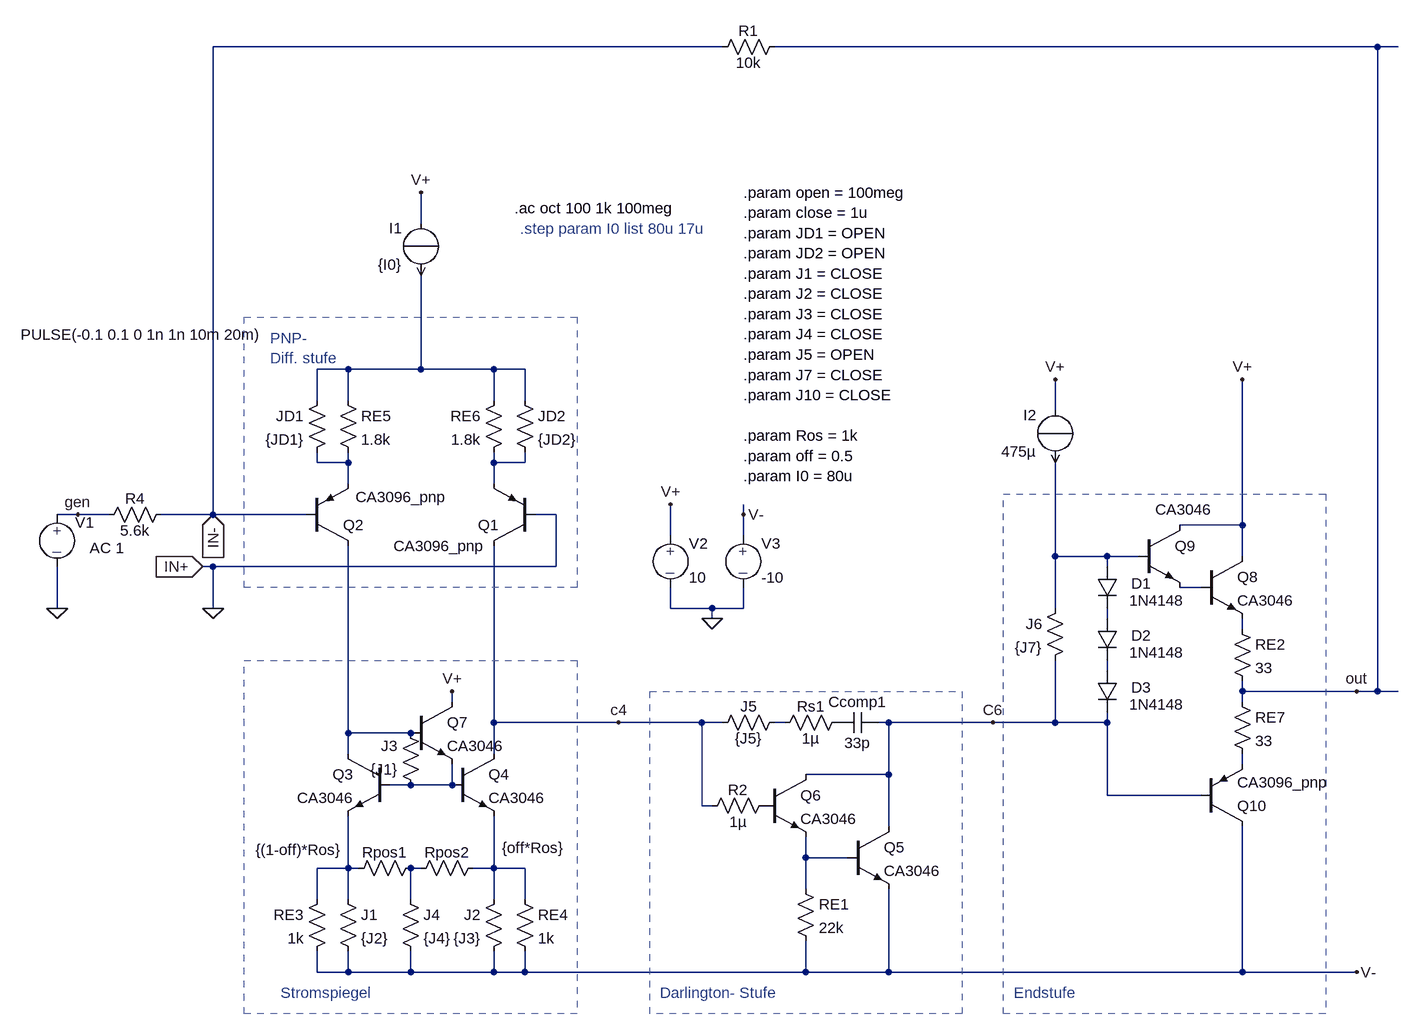
[diagram p0: schematic 2.7.1.4_transit.asc]
2.7.1.4_transit.asc, the LTspice schematic file:
Version 4
SHEET 1 1812 1396
WIRE 768 -560 -16 -560
WIRE 1776 -560 848 -560
WIRE 1808 -560 1776 -560
WIRE 304 -288 304 -336
WIRE 192 -64 144 -64
WIRE 304 -64 304 -208
WIRE 304 -64 192 -64
WIRE 416 -64 304 -64
WIRE 464 -64 416 -64
WIRE 144 -16 144 -64
WIRE 192 -16 192 -64
WIRE 416 -16 416 -64
WIRE 464 -16 464 -64
WIRE 1280 0 1280 -48
WIRE 144 80 144 64
WIRE 192 80 192 64
WIRE 192 80 144 80
WIRE 416 80 416 64
WIRE 464 80 464 64
WIRE 464 80 416 80
WIRE 192 112 192 80
WIRE 416 112 416 80
WIRE -224 160 -256 160
WIRE -176 160 -224 160
WIRE -16 160 -16 -560
WIRE -16 160 -96 160
WIRE 128 160 -16 160
WIRE 512 160 480 160
WIRE 800 160 800 144
WIRE 1568 176 1568 -48
WIRE 1568 176 1472 176
WIRE 688 192 688 144
WIRE 800 192 800 160
WIRE 1280 224 1280 80
WIRE 1360 224 1280 224
WIRE 1408 224 1360 224
WIRE 1568 224 1568 176
WIRE -16 240 -32 240
WIRE 512 240 512 160
WIRE 512 240 -16 240
WIRE 1360 240 1360 224
WIRE 1504 272 1472 272
WIRE -256 304 -256 240
WIRE -16 304 -16 240
WIRE 688 304 688 272
WIRE 752 304 688 304
WIRE 800 304 800 272
WIRE 800 304 752 304
WIRE 1280 304 1280 224
WIRE 752 320 752 304
WIRE 1360 320 1360 304
WIRE 1568 336 1568 320
WIRE 1360 400 1360 384
WIRE 1568 432 1568 416
WIRE 1744 432 1568 432
WIRE 1776 432 1776 -560
WIRE 1776 432 1744 432
WIRE 1808 432 1776 432
WIRE 352 448 352 432
WIRE 1568 448 1568 432
WIRE 416 480 416 208
WIRE 608 480 416 480
WIRE 736 480 608 480
WIRE 768 480 736 480
WIRE 864 480 848 480
WIRE 1024 480 1008 480
WIRE 1184 480 1024 480
WIRE 1280 480 1280 384
WIRE 1280 480 1184 480
WIRE 1360 480 1360 464
WIRE 1360 480 1280 480
WIRE 192 496 192 208
WIRE 288 496 192 496
WIRE 192 528 192 496
WIRE 416 528 416 480
WIRE 1568 544 1568 528
WIRE 1024 560 1024 480
WIRE 1024 560 896 560
WIRE 288 576 256 576
WIRE 352 576 352 544
WIRE 352 576 288 576
WIRE 1360 592 1360 480
WIRE 1504 592 1360 592
WIRE 736 608 736 480
WIRE 752 608 736 608
WIRE 1024 640 1024 560
WIRE 896 688 896 656
WIRE 960 688 896 688
WIRE 192 704 192 624
WIRE 192 704 144 704
WIRE 208 704 192 704
WIRE 304 704 288 704
WIRE 416 704 416 624
WIRE 416 704 384 704
WIRE 464 704 416 704
WIRE 896 736 896 688
WIRE 144 752 144 704
WIRE 192 752 192 704
WIRE 288 752 288 704
WIRE 416 752 416 704
WIRE 464 752 464 704
WIRE 144 864 144 832
WIRE 192 864 192 832
WIRE 192 864 144 864
WIRE 288 864 288 832
WIRE 288 864 192 864
WIRE 416 864 416 832
WIRE 416 864 288 864
WIRE 464 864 464 832
WIRE 464 864 416 864
WIRE 896 864 896 816
WIRE 896 864 464 864
WIRE 1024 864 1024 736
WIRE 1024 864 896 864
WIRE 1568 864 1568 640
WIRE 1568 864 1024 864
WIRE 1744 864 1568 864
FLAG -32 240 IN+
IOPIN -32 240 In
FLAG -16 160 IN-
IOPIN -16 160 In
FLAG -16 304 0
FLAG 752 320 0
FLAG 688 144 V+
FLAG 800 160 V-
FLAG 352 432 V+
FLAG 304 -336 V+
FLAG 1280 -48 V+
FLAG 1744 864 V-
FLAG 1184 480 C6
FLAG 608 480 c4
FLAG 1568 -48 V+
FLAG 1744 432 out
FLAG -256 304 0
FLAG -224 160 gen
SYMBOL EIT_Semiconductors\\pnp 480 208 R180
WINDOW 3 77 0 Left 0
SYMATTR Value CA3096_pnp
SYMATTR InstName Q1
SYMBOL EIT_Semiconductors\\pnp 128 208 M180
WINDOW 3 75 75 Left 0
SYMATTR Value CA3096_pnp
SYMATTR InstName Q2
SYMBOL source-V -256 144 R0
WINDOW 123 50 67 Left 0
WINDOW 39 0 0 Left 0
WINDOW 3 -56 -261 Left 0
SYMATTR Value2 AC 1
SYMATTR Value PULSE(-0.1 0.1 0 1n 1n 10m 20m)
SYMATTR InstName V1
SYMBOL source-I 304 -208 R180
WINDOW 0 29 73 Left 0
WINDOW 3 29 17 Left 0
WINDOW 123 0 0 Left 0
WINDOW 39 0 0 Left 0
SYMATTR InstName I1
SYMATTR Value {I0}
SYMBOL EIT_Semiconductors\\npn 256 528 M0
SYMATTR InstName Q3
SYMATTR Value CA3046
SYMBOL EIT_Semiconductors\\npn 352 528 R0
SYMATTR InstName Q4
SYMATTR Value CA3046
SYMBOL res 304 688 R90
WINDOW 0 7 56 VBottom 0
WINDOW 3 -28 188 VTop 0
SYMATTR InstName Rpos1
SYMATTR Value {(1-off)*Ros}
SYMBOL res 176 736 R0
SYMATTR InstName J1
SYMATTR Value {J2}
SYMBOL res 432 736 M0
SYMATTR InstName J2
SYMATTR Value {J3}
SYMBOL res 160 736 M0
SYMATTR InstName RE3
SYMATTR Value 1k
SYMBOL res 448 736 R0
SYMATTR InstName RE4
SYMATTR Value 1k
SYMBOL res 304 592 R180
WINDOW 0 36 76 Left 0
WINDOW 3 36 40 Left 0
SYMATTR InstName J3
SYMATTR Value {J1}
SYMBOL res 400 688 R90
WINDOW 0 7 56 VBottom 0
WINDOW 3 -31 -76 VTop 0
SYMATTR InstName Rpos2
SYMATTR Value {off*Ros}
SYMBOL res 272 736 R0
SYMATTR InstName J4
SYMATTR Value {J4}
SYMBOL source-V 688 176 R0
WINDOW 123 0 0 Left 0
WINDOW 39 0 0 Left 0
SYMATTR InstName V2
SYMATTR Value 10
SYMBOL source-V 800 176 R0
WINDOW 123 0 0 Left 0
WINDOW 39 0 0 Left 0
SYMATTR InstName V3
SYMATTR Value -10
SYMBOL res 176 -32 R0
SYMATTR InstName RE5
SYMATTR Value 1.8k
SYMBOL res 432 -32 M0
SYMATTR InstName RE6
SYMATTR Value 1.8k
SYMBOL res 160 -32 M0
SYMATTR InstName JD1
SYMATTR Value {JD1}
SYMBOL res 448 -32 R0
SYMATTR InstName JD2
SYMATTR Value {JD2}
SYMBOL res 752 496 R270
WINDOW 0 25 56 VTop 0
WINDOW 3 7 56 VBottom 0
SYMATTR InstName J5
SYMATTR Value {J5}
SYMBOL cap 1008 464 R90
WINDOW 0 0 32 VBottom 0
WINDOW 3 32 32 VTop 0
SYMATTR InstName Ccomp1
SYMATTR Value 33p
SYMBOL EIT_Semiconductors\\npn 960 640 R0
SYMATTR InstName Q5
SYMATTR Value CA3046
SYMBOL EIT_Semiconductors\\npn 832 560 R0
SYMATTR InstName Q6
SYMATTR Value CA3046
SYMBOL res 880 720 R0
SYMATTR InstName RE1
SYMATTR Value 22k
SYMBOL res 960 464 R90
WINDOW 0 7 56 VBottom 0
WINDOW 3 25 56 VTop 0
SYMATTR InstName Rs1
SYMATTR Value 1µ
SYMBOL source-I 1280 80 R180
WINDOW 0 29 73 Left 0
WINDOW 3 29 17 Left 0
WINDOW 123 0 0 Left 0
WINDOW 39 0 0 Left 0
SYMATTR InstName I2
SYMATTR Value 475µ
SYMBOL res 848 592 R90
WINDOW 0 7 56 VBottom 0
WINDOW 3 25 56 VTop 0
SYMATTR InstName R2
SYMATTR Value 1µ
SYMBOL EIT_Semiconductors\\npn 288 448 R0
SYMATTR InstName Q7
SYMATTR Value CA3046
SYMBOL EIT_Semiconductors\\npn 1504 224 R0
SYMATTR InstName Q8
SYMATTR Value CA3046
SYMBOL EIT_Semiconductors\\npn 1408 176 R0
WINDOW 3 26 -24 Left 0
SYMATTR Value CA3046
SYMATTR InstName Q9
SYMBOL EIT_Semiconductors\\pnp 1504 640 M180
SYMATTR InstName Q10
SYMATTR Value CA3096_pnp
SYMBOL res 1552 320 R0
SYMATTR InstName RE2
SYMATTR Value 33
SYMBOL res 1552 432 R0
SYMATTR InstName RE7
SYMATTR Value 33
SYMBOL diode 1344 240 R0
WINDOW 0 53 26 Left 0
WINDOW 3 50 52 Left 0
SYMATTR InstName D1
SYMATTR Value 1N4148
SYMBOL res 1296 288 M0
SYMATTR InstName J6
SYMATTR Value {J7}
SYMBOL diode 1344 320 R0
WINDOW 0 53 26 Left 0
WINDOW 3 50 52 Left 0
SYMATTR InstName D2
SYMATTR Value 1N4148
SYMBOL diode 1344 400 R0
WINDOW 0 53 26 Left 0
WINDOW 3 50 52 Left 0
SYMATTR InstName D3
SYMATTR Value 1N4148
SYMBOL res 864 -576 R90
WINDOW 0 7 56 VBottom 0
WINDOW 3 25 56 VTop 0
SYMATTR InstName R1
SYMATTR Value 10k
SYMBOL res -80 144 R90
WINDOW 0 7 56 VBottom 0
WINDOW 3 25 56 VTop 0
SYMATTR InstName R4
SYMATTR Value 5.6k
TEXT 72 -112 Left 0 ;PNP-\nDiff. stufe
TEXT 448 -312 Left 0 !.ac oct 100 1k 100meg
TEXT 88 896 Left 0 ;Stromspiegel
TEXT 800 -336 Left 0 !.param open = 100meg\n.param close = 1u\n.param JD1 = OPEN\n.param JD2 = OPEN\n.param J1 = CLOSE\n.param J2 = CLOSE\n.param J3 = CLOSE\n.param J4 = CLOSE\n.param J5 = OPEN\n.param J7 = CLOSE\n.param J10 = CLOSE\n \n.param Ros = 1k\n.param off = 0.5\n.param I0 = 80u
TEXT 456 -280 Left 0 ;.step param I0 list 80u 17u
TEXT 672 896 Left 0 ;Darlington- Stufe
TEXT 1216 896 Left 0 ;Endstufe
RECTANGLE Normal 544 272 32 -144 2
RECTANGLE Normal 544 928 32 384 2
RECTANGLE Normal 1136 928 656 432 2
RECTANGLE Normal 1696 928 1200 128 2

The netlist it stands for:
* 2.7.1.4_transit.asc
Q1 c4 0 N003 0 CA3096_pnp
Q2 N010 IN- N002 0 CA3096_pnp
V1 gen 0 PULSE(-0.1 0.1 0 1n 1n 10m 20m) AC 1
I1 V+ N001 {I0}
Q3 N010 N012 N014 0 CA3046
Q4 c4 N012 N016 0 CA3046
Rpos1 N015 N014 {(1-off)*Ros}
R§J1 N014 V- {J2}
R§J2 N016 V- {J3}
RE3 N014 V- 1k
RE4 N016 V- 1k
R§J3 N012 N010 {J1}
Rpos2 N016 N015 {off*Ros}
R§J4 N015 V- {J4}
V2 V+ 0 10
V3 V- 0 -10
RE5 N001 N002 1.8k
RE6 N001 N003 1.8k
R§JD1 N001 N002 {JD1}
R§JD2 N001 N003 {JD2}
R§J5 c4 N009 {J5}
Ccomp1 C6 P001 33p
Q5 C6 N013 V- 0 CA3046
Q6 C6 P002 N013 0 CA3046
RE1 N013 V- 22k
Rs1 P001 N009 1µ
I2 V+ N004 475µ
R2 P002 c4 1µ
Q7 V+ N010 N012 0 CA3046
Q8 V+ N005 N007 0 CA3046
Q9 V+ N004 N005 0 CA3046
Q10 V- C6 N011 0 CA3096_pnp
RE2 N007 out 33
RE7 out N011 33
D1 N004 N006 1N4148
R§J6 N004 C6 {J7}
D2 N006 N008 1N4148
D3 N008 C6 1N4148
R1 out IN- 10k
R4 IN- gen 5.6k
.model D D
.lib standard.dio
.model NPN NPN
.model PNP PNP
.lib standard.bjt
* PNP-
* Diff. stufe
.ac oct 100 1k 100meg
* Stromspiegel
.param open = 100meg
.param close = 1u
.param JD1 = OPEN
.param JD2 = OPEN
.param J1 = CLOSE
.param J2 = CLOSE
.param J3 = CLOSE
.param J4 = CLOSE
.param J5 = OPEN
.param J7 = CLOSE
.param J10 = CLOSE
.param Ros = 1k
.param off = 0.5
.param I0 = 80u
* .step param I0 list 80u 17u
* Darlington- Stufe
* Endstufe
.backanno
.end